# Altium schematic sheet mcu.SchDoc
size A; SheetNumber: 1; SheetTotal: 3
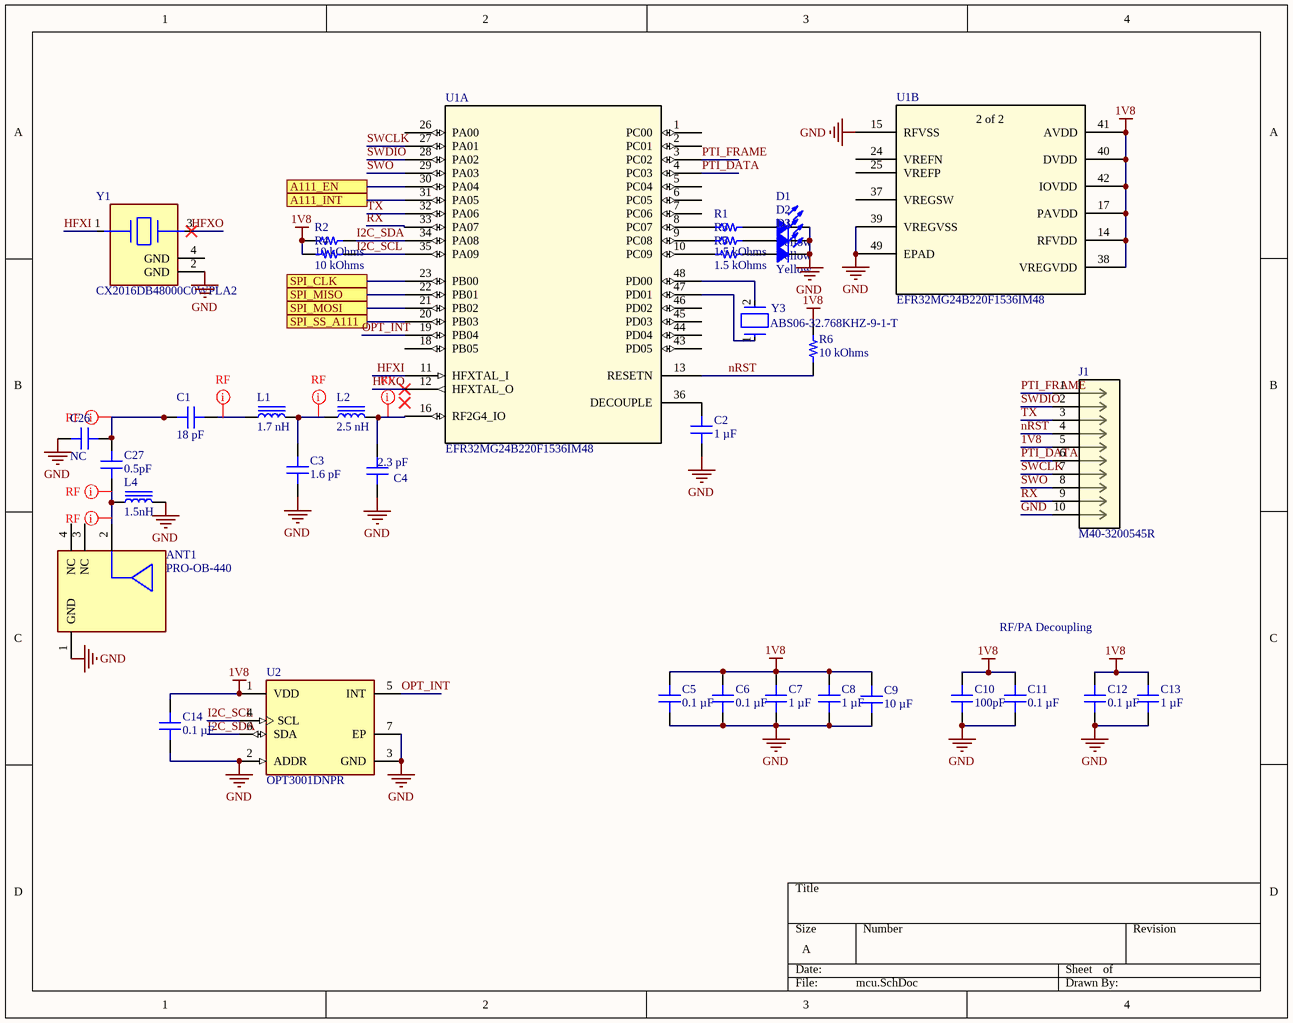
[diagram p0: mcu.SchDoc]

## Parts
ANT1  PRO-OB-440  [FP-PRO-OB-440-MFG]
C1  18 pF  [CAP 0402_1005 RF]
C2  1 µF  [CAP 0402_1005]
C3  1.6 pF  [CAP 0402_1005 RF]
C4  2.3 pF  [CAP 0402_1005 RF]
C5  0.1 µF  [CAP 0402_1005]
C6  0.1 µF  [CAP 0402_1005]
C7  1 µF  [CAP 0402_1005]
C8  1 µF  [CAP 0402_1005]
C9  10 µF  [CAP 0603_1608]
C10  100pF  [CAP 0402_1005]
C11  0.1 µF  [CAP 0402_1005]
C12  0.1 µF  [CAP 0402_1005]
C13  1 µF  [CAP 0402_1005]
C14  0.1 µF  [CAP 0402_1005]
C26  NC  [CAP 0402_1005 RF]
C27  0.5pF  [CAP 0402_1005 RF]
D1  Yellow  [LED 0402_1005 YELLOW]
D2  Yellow  [LED 0402_1005 YELLOW]
D3  Yellow  [LED 0402_1005 YELLOW]
J1  M40-3200545R  [CONN10_M40-3200545R_HRW]
L1  1.7 nH  [IND 0402_1005 RF WW]
L2  2.5 nH  [IND 0402_1005 RF WW]
L4  1.5nH  [IND 0402_1005 RF WW]
R1  (no value)  [RES 0402_1005]
R2  10 kOhms  [RES 0402_1005]
R3  1.5 kOhms  [RES 0402_1005]
R4  10 kOhms  [RES 0402_1005]
R5  1.5 kOhms  [RES 0402_1005]
R6  10 kOhms  [RES 0402_1005]
U1  EFR32MG24B220F1536IM48  [QFN48_0p4_6sq_SIL]  (parts A,B of 2)
U2  OPT3001DNPR  [FP-DNP0006A-MFG]
Y1  CX2016DB48000C0WPLA2  [FP-CX2016DB48000C0WPLA2-MFG]
Y3  ABS06-32.768KHZ-9-1-T  [FP-ABS06-MFG]

## Ports
A111_EN, A111_INT, SPI_CLK, SPI_MISO, SPI_MOSI, SPI_SS_A111

## Nets
1V8: C5.2 C6.2 C7.2 C8.2 C9.2 C10.2 C11.2 C12.2 C13.2 C14.2 J1.5 R2.2 R4.2 R6.1 U1.14(RFVDD) U1.17(PAVDD) U1.38(VREGVDD) U1.40(DVDD) U1.41(AVDD) U1.42(IOVDD) U2.1(VDD)
GND: ANT1.1(GND) C2.1 C3.1 C4.1 C5.1 C6.1 C7.1 C8.1 C9.1 C10.1 C11.1 C12.1 C13.1 C14.1 C26.1 D1.2 D2.2 D3.2 J1.10 L4.2 U1.15(RFVSS) U1.39(VREGVSS) U1.49(EPAD) U2.2(ADDR) U2.3(GND) U2.7(EP) Y1.2(GND)
A111_EN: U1.30(PA04) ; port A111_EN
A111_INT: U1.31(PA05) ; port A111_INT
HFXI: U1.11(HFXTAL_I) Y1.1(1_HOT)
HFXO: U1.12(HFXTAL_O) Y1.3(2_HOT)
I2C_SCL: R4.1 U1.35(PA09) U2.4(SCL)
I2C_SDA: R2.1 U1.34(PA08) U2.6(SDA)
nRST: J1.4 R6.2 U1.13(RESETN)
OPT_INT: U1.19(PB04) U2.5(INT)
PTI_DATA: J1.6 U1.4(PC03)
PTI_FRAME: J1.1 U1.3(PC02)
RX: J1.9 U1.33(PA07)
SPI_CLK: U1.23(PB00) ; port SPI_CLK
SPI_MISO: U1.22(PB01) ; port SPI_MISO
SPI_MOSI: U1.21(PB02) ; port SPI_MOSI
SPI_SS_A111: U1.20(PB03) ; port SPI_SS_A111
SWCLK: J1.7 U1.27(PA01)
SWDIO: J1.2 U1.28(PA02)
SWO: J1.8 U1.29(PA03)
TX: J1.3 U1.32(PA06)
NetANT1_2: ANT1.2(RF_FEED) C27.1 L4.1
NetC1_1: C1.1 C26.2 C27.2
NetC1_2: C1.2 L1.1
NetC2_2: C2.2 U1.36(DECOUPLE)
NetC3_2: C3.2 L1.2 L2.1
NetC4_2: C4.2 L2.2 U1.16(RF2G4_IO)
NetD1_1: D1.1 R1.1
NetD2_1: D2.1 R3.1
NetD3_1: D3.1 R5.1
NetR1_2: R1.2 U1.8(PC07)
NetR3_2: R3.2 U1.9(PC08)
NetR5_2: R5.2 U1.10(PC09)
NetU1_47: U1.47(PD01) Y3.1
NetU1_48: U1.48(PD00) Y3.2

Not connected (* = marked no-connect by the designer): ANT1 3(NC) 4(NC); U1 1(PC00) 2(PC01) 5(PC04) 6(PC05) 7(PC06) 18(PB05) 24(VREFN) 25(VREFP) 26(PA00) 37(VREGSW) 43(PD05) 44(PD04) 45(PD03) 46(PD02); Y1 4(GND)

## Layout directives
net class RF: NetANT1_2, NetC1_1, NetC1_2, NetC3_2, NetC4_2

## Notes on the sheet
- RF/PA Decoupling
- (in symbol EFR32MG24B220F1536IM48, part B) 2 of 2

## Library data of the parts
ANT1 = CMP-231248-000001-1: RF ANT 2.4GHZ STAMPED MET SLD; Manufacturer: ProAnt; Return Loss: -10dB; Impedance: 50Ω; Max Frequency: 2500MHz; Number Of Bands: 1; Bandwidth: 2400-2500MHz; Temperature Range Low: -40°C; Height: 3.53mm; ComponentLink2URL: http://www.proant.se/files/user/Documents/Datasheets%20and%20appnotes/Upload%202018-06-08/Application%20note%20-%20OnBoard%20SMD%202400%20MHz%20rev%203.2.pdf; Octopart: https://octopart.com/pro-ob-440-proant+ab-62921801; Digikey Description: RF ANT 2.4GHZ STAMPED MET SLD; Device Class L1: Integrated Circuits (ICs); ComponentLink2Description: Datasheet; Package: PRO-OB-440; Temperature: -40°C to +125°C; Category: Ant; Lead Free: Yes; Device Class L3: RF Antennas; RoHS: TRUE; Automotive: No; Device Class L2: RF Semiconductors and Devices; Manufacturer Part Number: PRO-OB-440; Temperature Range High: +125°C
C1 C27 = 600L180FW200T: CAP CER 18PF 200V NP0 0402; manufacturer: American Technical Ceramics; Temperature Coefficient: C0G, NP0; Tolerance: ±1%; Part Number: 600L180FW200T; Applications: RF, Microwave, High Frequency, Bypass, Decoupling; componentlink1description: Datasheet; componentlink1url: http://www.atceramics.com/UserFiles/600l.pdf; componentlink2description: DigiKey Link; componentlink2url: https://www.digikey.com/en/products/detail/american-technical-ceramics/600L180FW200T/3908918; Device Package: 0402 (1005 Metric); Features: High Q, Low Loss, Ultra Low ESR; lastupdated: 1/9/2022 1:07:41 pm; Lifecycle Status: Active; Minimum Order: 1; Mounting Type: Surface Mount, MLCC; Operating Temperature: -55°C ~ 125°C; Package / Case: 0402 (1005 Metric); packaging: TapeAndReel; partid: 1343; Part Status: Active; price: 0.49; series: ATC 600L; Size / Dimension: 0.040" L x 0.020" W (1.02mm x 0.51mm); Supplier 1: DigiKey; Supplier Part Number 1: 478-12298-1-ND; Thickness (Max): 0.024" (0.60mm); Voltage - Rated: 200V
  C1: Capacitance: 18 pF; value: 18 pF
  C27: Capacitance: 0.5pF; value: 0.5pF
C2 C5 C11 C12 C14 = C0402C104K7PAC7867: CAP CER 0.1UF 4V X5R 0402; manufacturer: KEMET; Tolerance: ±10%; Part Number: C0402C104K7PAC7867; Applications: Bypass, Decoupling; componentlink1description: Datasheet; componentlink1url: https://api.kemet.com/component-edge/download/datasheet/C0402C104K7PAC7867.pdf; componentlink2description: DigiKey Link; componentlink2url: https://www.digikey.com/en/products/detail/kemet/C0402C104K7PAC7867/7381987; Device Package: 0402 (1005 Metric); lastupdated: 1/9/2022 12:30:40 pm; Lifecycle Status: Active; Minimum Order: 1; Mounting Type: Surface Mount, MLCC; Operating Temperature: -55°C ~ 85°C; Package / Case: 0402 (1005 Metric); packaging: TapeAndReel; partid: 5603; Part Status: Active; price: 0.01; series: SMD Comm X5R; Size / Dimension: 0.039" L x 0.020" W (1.00mm x 0.50mm); Supplier 1: DigiKey; Supplier Part Number 1: 399-14871-1-ND; Temperature Coefficient: X5R; Thickness (Max): 0.022" (0.55mm); Voltage - Rated: 4V
  C2: Value: 1 µF; Capacitance: 1 µF
  C5 C11 C12 C14: Value: 0.1 µF; Capacitance: 0.1 µF
C3 = GJM1555C1H1R6CB01D: CAP CER 1.6PF 50V C0G/NP0 0402; manufacturer: Murata Electronics; Temperature Coefficient: C0G, NP0; Tolerance: ±0.25pF; Part Number: GJM1555C1H1R6CB01D; Applications: RF, Microwave, High Frequency; Capacitance: 1.6 pF; componentlink1description: Datasheet; componentlink1url: https://search.murata.co.jp/Ceramy/image/img/A01X/G101/ENG/GJM1555C1H1R6CB01-01.pdf; componentlink2description: DigiKey Link; componentlink2url: https://www.digikey.com/en/products/detail/murata-electronics/GJM1555C1H1R6CB01D/702281; Device Package: 0402 (1005 Metric); Features: High Q, Low Loss; lastupdated: 1/9/2022 1:07:42 pm; Lifecycle Status: Active; Minimum Order: 1; Mounting Type: Surface Mount, MLCC; Operating Temperature: -55°C ~ 125°C; Package / Case: 0402 (1005 Metric); packaging: TapeAndReel; partid: 624; Part Status: Active; price: 0.01; series: GJM; Size / Dimension: 0.039" L x 0.020" W (1.00mm x 0.50mm); Supplier 1: DigiKey; Supplier Part Number 1: 490-3088-1-ND; Thickness (Max): 0.022" (0.55mm); value: 1.6 pF; Voltage - Rated: 50V
C4 = GJM1555C1H2R3BB01D: CAP CER 2.3PF 50V C0G/NP0 0402; manufacturer: Murata Electronics; Temperature Coefficient: C0G, NP0; Tolerance: ±0.1pF; Part Number: GJM1555C1H2R3BB01D; Applications: RF, Microwave, High Frequency; Capacitance: 2.3 pF; componentlink1description: Datasheet; componentlink1url: https://search.murata.co.jp/Ceramy/image/img/A01X/G101/ENG/GJM1555C1H2R3BB01-01.pdf; componentlink2description: DigiKey Link; componentlink2url: https://www.digikey.com/en/products/detail/murata-electronics/GJM1555C1H2R3BB01D/2592923; Device Package: 0402 (1005 Metric); Features: High Q, Low Loss; lastupdated: 1/9/2022 1:07:39 pm; Lifecycle Status: Active; Minimum Order: 1; Mounting Type: Surface Mount, MLCC; Operating Temperature: -55°C ~ 125°C; Package / Case: 0402 (1005 Metric); packaging: TapeAndReel; partid: 2854; Part Status: Active; price: 0.02; series: GJM; Size / Dimension: 0.039" L x 0.020" W (1.00mm x 0.50mm); Supplier 1: DigiKey; Supplier Part Number 1: 490-GJM1555C1H2R3BB01DCT-ND; Thickness (Max): 0.022" (0.55mm); value: 2.3 pF; Voltage - Rated: 50V
C6 = C0402C104K4RECAUTO: CAP CER 0402 0.1UF 16V X7R 10%; manufacturer: KEMET; Part Number: C0402C104K4RECAUTO; Value: 0.1 µF; Applications: Automotive, ESD Protection; Capacitance: 0.1 µF; componentlink1description: Datasheet; componentlink1url: https://api.kemet.com/component-edge/download/datasheet/C0402C104K4RECAUTO.pdf; componentlink2description: DigiKey Link; componentlink2url: https://www.digikey.com/en/products/detail/kemet/C0402C104K4RECAUTO/8563695; Device Package: 0402 (1005 Metric); lastupdated: 1/9/2022 12:30:53 pm; Lifecycle Status: Active; Minimum Order: 1; Mounting Type: Surface Mount, MLCC; Operating Temperature: -55°C ~ 125°C; Package / Case: 0402 (1005 Metric); packaging: TapeAndReel; partid: 1731; Part Status: Active; price: 0.01; Ratings: AEC-Q200; series: ESD SMD Auto X7R; Size / Dimension: 0.039" L x 0.020" W (1.00mm x 0.50mm); Supplier 1: DigiKey; Supplier Part Number 1: 399-17167-1-ND; Temperature Coefficient: X7R; Thickness (Max): 0.022" (0.55mm); Tolerance: ±10%; Voltage - Rated: 16V
C7 C8 = LMK105BJ105MVHF: CAP CER 1UF 10V X5R 0402; manufacturer: Taiyo Yuden; Tolerance: ±20%; Part Number: LMK105BJ105MVHF; Value: 1 µF; Applications: Automotive, SMPS Filtering; Capacitance: 1 µF; componentlink1description: Datasheet; componentlink1url: https://ds.yuden.co.jp/TYCOMPAS/ut/detail?pn=LMK105BJ105MVHF &u=M; componentlink2description: DigiKey Link; componentlink2url: https://www.digikey.com/en/products/detail/taiyo-yuden/LMK105BJ105MVHF/7403746; Device Package: 0402 (1005 Metric); lastupdated: 1/9/2022 12:30:35 pm; Lifecycle Status: Active; Minimum Order: 1; Mounting Type: Surface Mount, MLCC; Operating Temperature: -55°C ~ 85°C; Package / Case: 0402 (1005 Metric); packaging: TapeAndReel; partid: 46675; Part Status: Active; price: 0.01; Ratings: AEC-Q200; series: M; Size / Dimension: 0.039" L x 0.020" W (1.00mm x 0.50mm); Supplier 1: DigiKey; Supplier Part Number 1: 587-6276-1-ND; Temperature Coefficient: X5R; Thickness (Max): 0.022" (0.55mm); Voltage - Rated: 10V
C9 = GRM188R60J106ME47D: CAP CER 10UF 6.3V X5R 0603; manufacturer: Murata Electronics; Tolerance: ±20%; Part Number: GRM188R60J106ME47D; Value: 10 µF; Applications: General Purpose; Capacitance: 10 µF; componentlink1description: Datasheet; componentlink1url: https://www.murata.com/~/media/webrenewal/support/library/catalog/products/capacitor/mlcc/c02e.ashx?la=en-us; componentlink2description: DigiKey Link; componentlink2url: https://www.digikey.com/en/products/detail/murata-electronics/GRM188R60J106ME47D/965910; Device Package: 0603 (1608 Metric); lastupdated: 11/9/2022 9:40:24 am; Lifecycle Status: Active; Minimum Order: 1; Mounting Type: Surface Mount, MLCC; Operating Temperature: -55°C ~ 85°C; Package / Case: 0603 (1608 Metric); packaging: TapeAndReel; partid: 2351; Part Status: Active; price: 0.02; series: GRM; Size / Dimension: 0.063" L x 0.031" W (1.60mm x 0.80mm); Supplier 1: DigiKey; Supplier Part Number 1: 490-3896-1-ND; Temperature Coefficient: X5R; Thickness (Max): 0.035" (0.90mm); Voltage - Rated: 6.3V
C10 = 04026C101KAT2A: CAP CER 100PF 6.3V X7R 0402; manufacturer: AVX Corporation; Tolerance: ±10%; Part Number: 04026C101KAT2A; Value: 100pF; Applications: General Purpose; Capacitance: 100pF; componentlink1description: Datasheet; componentlink1url: http://datasheets.avx.com/X7RDielectric.pdf; componentlink2description: DigiKey Link; componentlink2url: http://digikey.com/product-detail/en/avx-corporation/04026C101KAT2A/478-12647-1-ND/9949180; Device Package: 0402 (1005 Metric); lastupdated: 8/2/2022 12:26:54 pm; Lifecycle Status: Active; Minimum Order: 1; Mounting Type: Surface Mount, MLCC; Operating Temperature: -55°C ~ 125°C; Package / Case: 0402 (1005 Metric); packaging: TapeAndReel; partid: 4266; Part Status: Active; price: 0.04; series: -; Size / Dimension: 0.039" L x 0.020" W (1.00mm x 0.50mm); Supplier 1: DigiKey; Supplier Part Number 1: 478-12647-1-ND; Temperature Coefficient: X7R; Thickness (Max): 0.022" (0.56mm); Voltage - Rated: 6.3V
C13 = CGB2T1X5R0G105M022BC: CAP CER 1UF 4V X5R 0402; manufacturer: TDK Corporation; Tolerance: ±20%; Part Number: CGB2T1X5R0G105M022BC; Value: 1 µF; Applications: General Purpose; Capacitance: 1 µF; componentlink1description: Datasheet; componentlink1url: https://product.tdk.com/info/en/catalog/datasheets/mlcc_commercial_lowprofile_en.pdf?ref_disty=digikey; componentlink2description: DigiKey Link; componentlink2url: https://www.digikey.com/en/products/detail/tdk-corporation/CGB2T1X5R0G105M022BC/4278344; Device Package: 0402 (1005 Metric); Features: Low Profile; lastupdated: 1/9/2022 12:30:48 pm; Lifecycle Status: Active; Minimum Order: 1; Mounting Type: Surface Mount, MLCC; Operating Temperature: -55°C ~ 85°C; Package / Case: 0402 (1005 Metric); packaging: TapeAndReel; partid: 2563; Part Status: Active; price: 0.08; series: CGB; Size / Dimension: 0.039" L x 0.020" W (1.00mm x 0.50mm); Supplier 1: DigiKey; Supplier Part Number 1: 445-15611-1-ND; Temperature Coefficient: X5R; Thickness (Max): 0.009" (0.22mm); Voltage - Rated: 4V
C26 = 600L180FW200T: CAP CER 18PF 200V NP0 0402; manufacturer: American Technical Ceramics; Capacitance: NA; Temperature Coefficient: C0G, NP0; Tolerance: ±1%; Part Number: 600L180FW200T; Applications: RF, Microwave, High Frequency, Bypass, Decoupling; componentlink1description: Datasheet; componentlink1url: http://www.atceramics.com/UserFiles/600l.pdf; componentlink2description: DigiKey Link; componentlink2url: https://www.digikey.com/en/products/detail/american-technical-ceramics/600L180FW200T/3908918; Device Package: 0402 (1005 Metric); Features: High Q, Low Loss, Ultra Low ESR; lastupdated: 1/9/2022 1:07:41 pm; Lifecycle Status: Active; Minimum Order: 1; Mounting Type: Surface Mount, MLCC; Operating Temperature: -55°C ~ 125°C; Package / Case: 0402 (1005 Metric); packaging: TapeAndReel; partid: 1343; Part Status: Active; price: 0.49; series: ATC 600L; Size / Dimension: 0.040" L x 0.020" W (1.02mm x 0.51mm); Supplier 1: DigiKey; Supplier Part Number 1: 478-12298-1-ND; Thickness (Max): 0.024" (0.60mm); value: NC; Voltage - Rated: 200V
D1-D3 = BL-HKC37A-AV-TRB: 0402 YELLOW; Manufacturer: American Bright Optoelectronics Corporation; Configuration: Standard; Current - Test: 20mA; Lens Color: Colorless; Lens Style: Rectangle with Flat Top; Lens Transparency: Clear; Millicandela Rating: 120mcd; Viewing Angle: 120°; Voltage - Forward (Vf) (Typ): 2.2V; Wavelength - Dominant: 589nm; Wavelength - Peak: 590nm; Part Number: BL-HKC37A-AV-TRB; Color: Yellow; ComponentLink1Description: Datasheet; ComponentLink1URL: https://americanbrightled.com/pdffiles/smt/BL-HKC37A-AV-TRB.pdf; ComponentLink2Description: DigiKey Link; ComponentLink2URL: https://www.digikey.com/en/products/detail/american-bright-optoelectronics-corporation/BL-HKC37A-AV-TRB/9678171; Device Package: 0402 (1005 Metric); Height (Max): 0.45mm; LastUpdated: 11/9/2022 10:29:51 am; Lifecycle Status: Active; Minimum Order: 1; Mounting Type: Surface Mount; Package / Case: 0402 (1005 Metric); Packaging: TapeAndReel; PartId: 1041; Part Status: Active; Price: 0.06; Series: -; Size / Dimension: 1.00mm L x 0.50mm W; Supplier 1: DigiKey; Supplier Part Number 1: BL-HKC37A-AV-TRBCT-ND; Supplier Device Package: 0402; Value: Yellow
J1 = M40-3200545R: No Description Available; Mfr_Name: Harwin; Copyright: Copyright (C) 2022 Ultra Librarian. All rights reserved.; Manufacturer_Part_Number: M40-3200545R; RefDes: RefDes; Type: DEV
L1 L4 = LQW15AN1N7D8ZD: FIXED IND 1.7NH 1.15A 65MOHM SMD; Manufacturer: Murata Electronics; DC Resistance (DCR): 65mOhm Max; Frequency - Self Resonant: 18GHz; Inductance Frequency - Test: 100 MHz; Material - Core: Non-Magnetic; Q @ Freq: 20 @ 250MHz; Shielding: Unshielded; Tolerance: ±0.5nH; Type: Wirewound; Part Number: LQW15AN1N7D8ZD; ComponentLink1Description: Datasheet; ComponentLink1URL: https://search.murata.co.jp/Ceramy/image/img/P02/JELF243A-9138.pdf; ComponentLink2Description: DigiKey Link; ComponentLink2URL: https://www.digikey.com/en/products/detail/murata-electronics/LQW15AN1N7D8ZD/6798783; Current Rating (Amps): 1.15 A; Device Package: 0402 (1005 Metric); Height - Seated (Max): 0.024" (0.60mm); Inductance: 1.7 nH; LastUpdated: 1/9/2022 1:17:33 pm; Lifecycle Status: Active; Minimum Order: 1; Mounting Type: Surface Mount; Operating Temperature: -55°C ~ 125°C; Package / Case: 0402 (1005 Metric); Packaging: TapeAndReel; PartId: 80; Part Status: Active; Price: 0.07; Ratings: AEC-Q200; Series: LQW15; Size / Dimension: 0.039" L x 0.024" W (1.00mm x 0.60mm); Supplier 1: DigiKey; Supplier Part Number 1: 490-15358-1-ND; Supplier Device Package: 0402 (1005 Metric)
  L1: Value: 1.7 nH
  L4: Value: 1.5nH
L2 = LQW15AN2N5B00D: FIXED IND 2.5NH 850MA 50MOHM SMD; Manufacturer: Murata Electronics; DC Resistance (DCR): 50mOhm Max; Frequency - Self Resonant: 15GHz; Inductance Frequency - Test: 100 MHz; Material - Core: Non-Magnetic; Q @ Freq: 20 @ 250MHz; Shielding: Unshielded; Tolerance: ±0.1nH; Type: Wirewound; Part Number: LQW15AN2N5B00D; ComponentLink1Description: Datasheet; ComponentLink1URL: https://search.murata.co.jp/Ceramy/image/img/P02/JELF243A-0050.pdf; ComponentLink2Description: DigiKey Link; ComponentLink2URL: https://www.digikey.com/en/products/detail/murata-electronics/LQW15AN2N5B00D/2594886; Current Rating (Amps): 850 mA; Device Package: 0402 (1005 Metric); Height - Seated (Max): 0.024" (0.60mm); Inductance: 2.5 nH; LastUpdated: 1/9/2022 1:17:31 pm; Lifecycle Status: Active; Minimum Order: 1; Mounting Type: Surface Mount; Operating Temperature: -55°C ~ 125°C; Package / Case: 0402 (1005 Metric); Packaging: TapeAndReel; PartId: 337; Part Status: Active; Price: 0.05; Series: LQW15; Size / Dimension: 0.039" L x 0.024" W (1.00mm x 0.60mm); Supplier 1: DigiKey; Supplier Part Number 1: 490-8437-1-ND; Value: 2.5 nH
R1 = ERA-2VRW1501X: RES 1.5K OHM 0.05% 1/10W 0402; Manufacturer: Panasonic Electronic Components; Power (Watts): 0.1W, 1/10W; Resistance: 1.5 kOhms; Temperature Coefficient: ±10ppm/°C; Part Number: ERA-2VRW1501X; ComponentLink1Description: Datasheet; ComponentLink1URL: https://api.pim.na.industrial.panasonic.com/file_stream/main/fileversion/9152; ComponentLink2Description: DigiKey Link; ComponentLink2URL: https://www.digikey.com/en/products/detail/panasonic-electronic-components/ERA-2VRW1501X/12086957; Composition: Thin Film; Device Package: 0402 (1005 Metric); Features: Anti-Sulfur, Automotive AEC-Q200; Height - Seated (Max): 0.016" (0.40mm); LastUpdated: 11/9/2022 9:53:08 am; Lifecycle Status: Active; Minimum Order: 1; Number of Terminations: 2; Operating Temperature: -55°C ~ 155°C; Package / Case: 0402 (1005 Metric); Packaging: TapeAndReel; PartId: 67400; Part Status: Active; Price: 0.24; Ratings: AEC-Q200; Series: ERA-2V; Size / Dimension: 0.039" L x 0.020" W (1.00mm x 0.50mm); Supplier 1: DigiKey; Supplier Part Number 1: 10-ERA-2VRW1501XCT-ND; Supplier Device Package: 0402; Tolerance: ±0.05%
R2 R4 R6 = RP73PF1E10KBTD: RES 10K OHM 0.1% 1/10W 0402; Manufacturer: TE Connectivity Passive Product; Power (Watts): 0.1W, 1/10W; Temperature Coefficient: ±25ppm/°C; Part Number: RP73PF1E10KBTD; Value: 10 kOhms; ComponentLink1Description: Datasheet; ComponentLink1URL: https://www.te.com/commerce/DocumentDelivery/DDEController?Action=srchrtrv&DocNm=1773272&DocType=DS&DocLang=English; ComponentLink2Description: DigiKey Link; ComponentLink2URL: https://www.digikey.com/en/products/detail/te-connectivity-passive-product/RP73PF1E10KBTD/8260957; Composition: Thin Film; Device Package: 0402 (1005 Metric); Height - Seated (Max): 0.014" (0.35mm); LastUpdated: 1/9/2022 12:46:57 pm; Lifecycle Status: Active; Minimum Order: 1; Number of Terminations: 2; Operating Temperature: -55°C ~ 155°C; Package / Case: 0402 (1005 Metric); Packaging: TapeAndReel; PartId: 2434; Part Status: Active; Price: 0.09; Resistance: 10 kOhms; Series: RP73, Holsworthy; Size / Dimension: 0.039" L x 0.020" W (1.00mm x 0.50mm); Supplier 1: DigiKey; Supplier Part Number 1: A127415CT-ND; Supplier Device Package: 0402; Tolerance: ±0.1%
R3 R5 = ERA-2VRW1501X: RES 1.5K OHM 0.05% 1/10W 0402; Manufacturer: Panasonic Electronic Components; Power (Watts): 0.1W, 1/10W; Temperature Coefficient: ±10ppm/°C; Part Number: ERA-2VRW1501X; Value: 1.5 kOhms; ComponentLink1Description: Datasheet; ComponentLink1URL: https://api.pim.na.industrial.panasonic.com/file_stream/main/fileversion/9152; ComponentLink2Description: DigiKey Link; ComponentLink2URL: https://www.digikey.com/en/products/detail/panasonic-electronic-components/ERA-2VRW1501X/12086957; Composition: Thin Film; Device Package: 0402 (1005 Metric); Features: Anti-Sulfur, Automotive AEC-Q200; Height - Seated (Max): 0.016" (0.40mm); LastUpdated: 11/9/2022 9:53:08 am; Lifecycle Status: Active; Minimum Order: 1; Number of Terminations: 2; Operating Temperature: -55°C ~ 155°C; Package / Case: 0402 (1005 Metric); Packaging: TapeAndReel; PartId: 67400; Part Status: Active; Price: 0.24; Ratings: AEC-Q200; Resistance: 1.5 kOhms; Series: ERA-2V; Size / Dimension: 0.039" L x 0.020" W (1.00mm x 0.50mm); Supplier 1: DigiKey; Supplier Part Number 1: 10-ERA-2VRW1501XCT-ND; Supplier Device Package: 0402; Tolerance: ±0.05%
U1 = EFR32MG24B220F1536IM48: No Description Available; Mfr_Name: Silicon Labs; Copyright: Copyright (C) 2022 Ultra Librarian. All rights reserved.; Manufacturer_Part_Number: EFR32MG24B220F1536IM48; RefDes: RefDes; Type: DEV
U2 = CMP-04942-000002-1: SENSOR OPT 550NM AMBIENT 6USON; Manufacturer: Texas Instruments; Max Junction Temp: +150°C; Operating Supply Current: 0.3-1.8uA; Sensor Output: I2C,SMBus; Max Supply Voltage: 3.6V; Min Supply Voltage: 1.6V; Standoff Height: 0mm; Package: DNP0006A; Device Class L2: Optical Sensors; Temperature Range Low: -40°C; Digikey Description: SENSOR OPT 550NM AMBIENT 6USON; Automotive: No; Category: IC; Manufacturer Part Number: OPT3001DNPR; RoHS: TRUE; ComponentLink2URL: http://www.ti.com/lit/ds/symlink/opt3001.pdf; Lead Free: Yes; Octopart: https://octopart.com/opt3001dnpr-texas+instruments-47324050; Device Class L3: unset; ComponentLink2Description: Datasheet; Device Class L1: Sensors; Temperature Range High: +85°C; Temperature: -40°C to +85°C; Height: 0.65mm; Ipc Land Pattern Name: DFN200X200X60-6
Y1 = CMP-20727-000003-1: CRYSTAL 48.0000MHZ 7PF SMD; Manufacturer: Kyocera; Tolerance: 20ppm; Esr: 22Ω; Frequency: 48000kHz; Height: 0.45mm; Load Capacitance: 7pF; Temperature: -40°C to +85°C; Automotive: No; Temperature Range High: +85°C; Octopart: https://octopart.com/cx2016db48000c0wpla2-avx+%2F+kyocera-52876167; Device Class L2: Crystals / Oscillators; Lead Free: Yes; Digikey Description: CRYSTAL 48.0000MHZ 7PF SMD; Mouser Description: Crystals 48MHz 7pF; Device Class L1: Passive Components; RoHS: TRUE; Temperature Range Low: -40°C; Package: 0; ComponentLink2Description: Datasheet; Device Class L3: Crystals; Series: CX2016DB; Category: Crys; ComponentLink2URL: https://global.kyocera.com/prdct/electro/product/pdf/cx2016db_e.pdf; Manufacturer Part Number: CX2016DB48000C0WPLA2
Y3 = CMP-27762-003430-2: Crystal 32.768kHz ±10ppm (Tol) 9pF FUND 90kΩ 2-Pin Mini-CSMD T/R; Series Resistance: 90kR; Series: ABS06; Case/Package: CSMD; Package Quantity: 3000; Load Capacitance: 9pF; Number of Pins: 2; Tolerance: 10ppm; RoHS Compliant: Yes; Depth: 1.2mm; Termination: SMD/SMT; Min Operating Temperature: -40°C; Length: 2mm; Packaging: Tape and Reel; Max Operating Temperature: 85°C; Frequency Tolerance: 10ppm; Width: 1.2mm; ESR (Equivalent Series Resistance): 90kR; Radiation Hardening: No; Frequency: 32.768kHz; REACH SVHC: No SVHC; Mount: Surface Mount; Height: 0.6mm